# EAGLE schematic LiFePo4 Charger Single to Chain 3.2 SMD -- Finished (EAGLE 6.2)
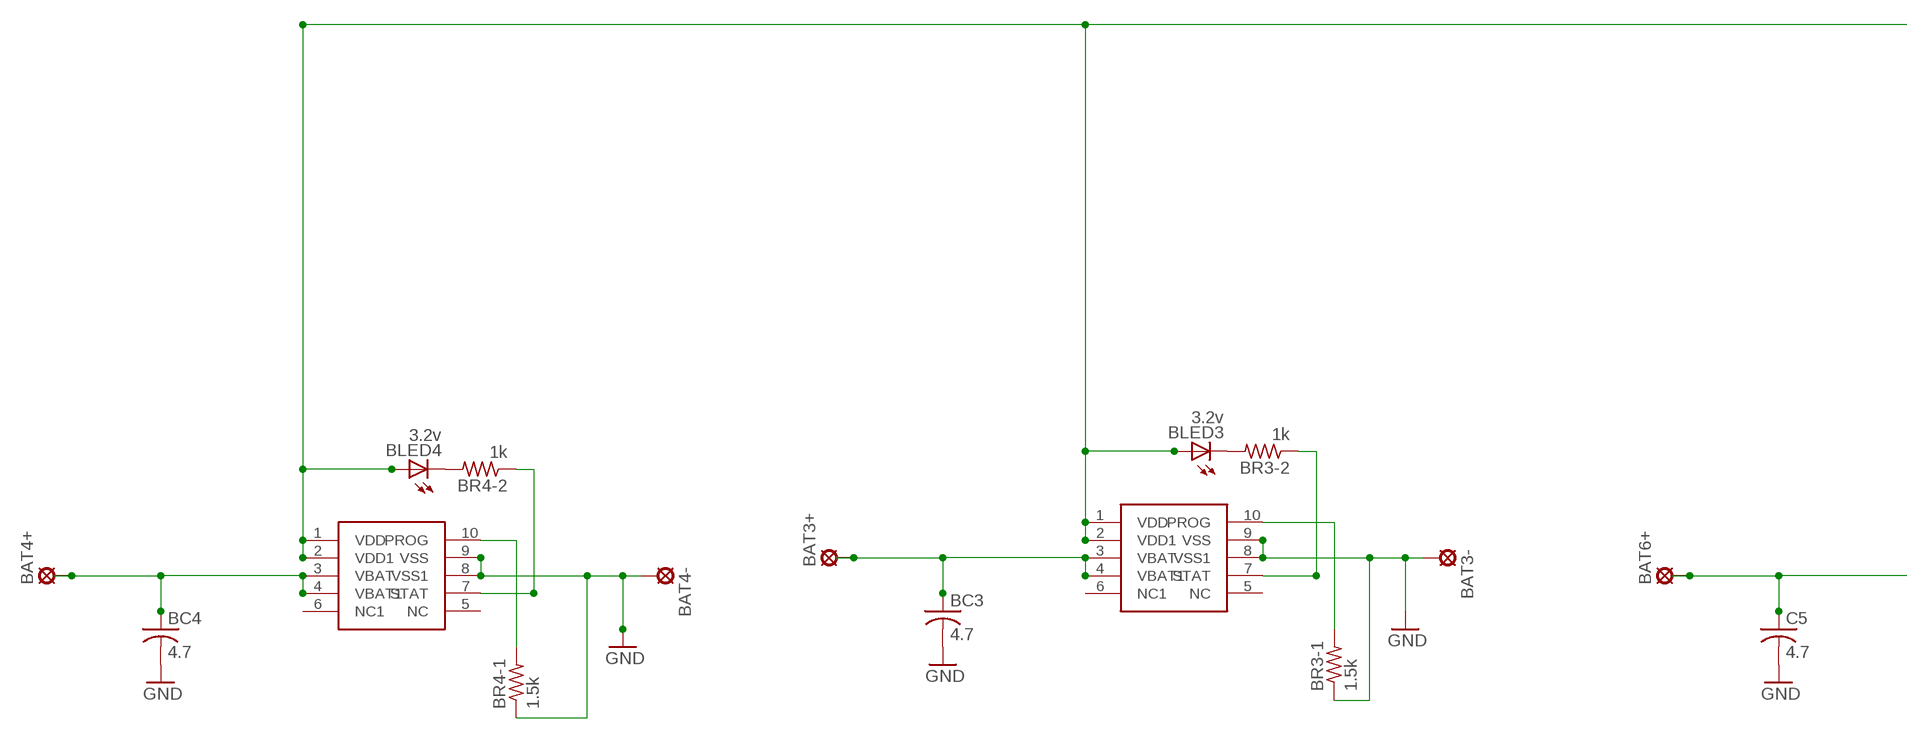
[diagram p0: schematic, sheet 1, part 1 of 2]
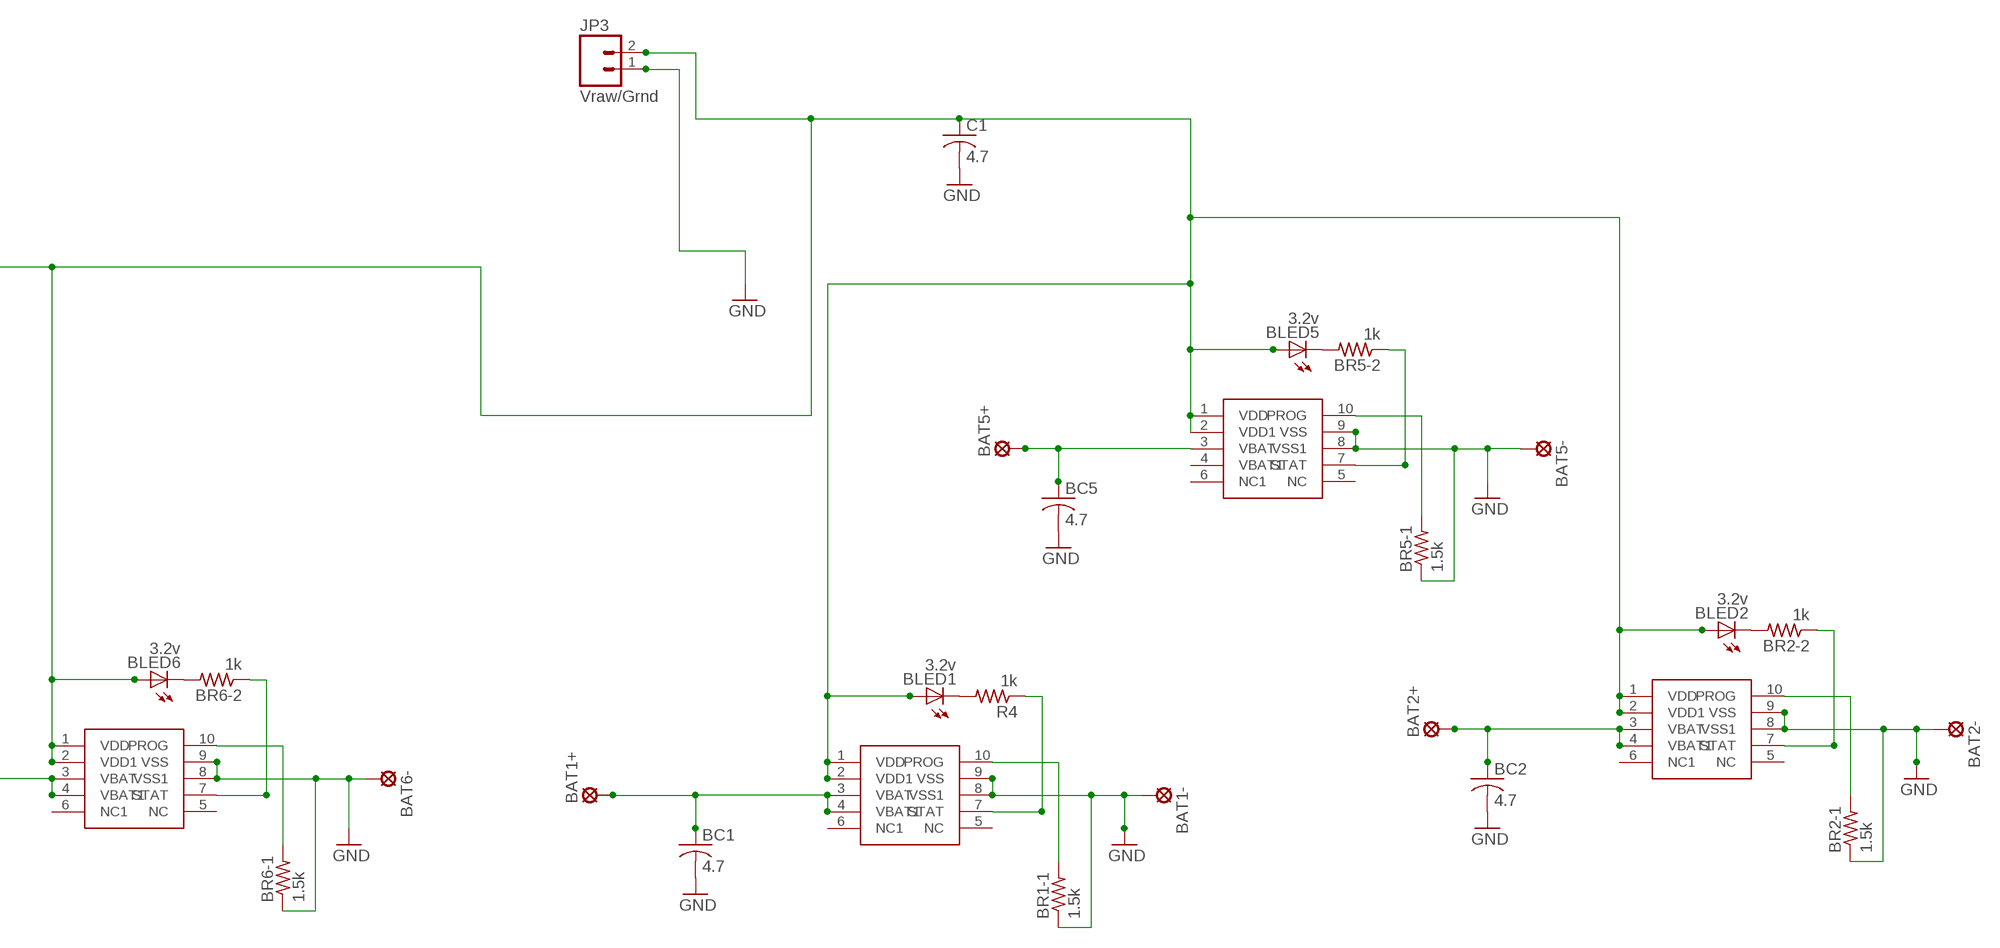
[diagram p1: schematic, sheet 1, part 2 of 2]

## Parts
BAT1+  SE14  [SE14]
BAT1-  SE14  [SE14]
BAT2+  SE14  [SE14]
BAT2-  SE14  [SE14]
BAT3+  SE14  [SE14]
BAT3-  SE14  [SE14]
BAT4+  SE14  [SE14]
BAT4-  SE14  [SE14]
BAT5+  SE14  [SE14]
BAT5-  SE14  [SE14]
BAT6+  SE14  [SE14]
BAT6-  SE14  [SE14]
BC1  4.7  C-USC0805  [C0805]
BC2  4.7  C-USC0805  [C0805]
BC3  4.7  C-USC0805  [C0805]
BC4  4.7  C-USC0805  [C0805]
BC5  4.7  C-USC0805  [C0805]
BLED1  3.2v  LEDSML0603  [SML0603]
BLED2  3.2v  LEDSML0603  [SML0603]
BLED3  3.2v  LEDSML0603  [SML0603]
BLED4  3.2v  LEDSML0603  [SML0603]
BLED5  3.2v  LEDSML0603  [SML0603]
BLED6  3.2v  LEDSML0603  [SML0603]
BR1-1  1.5k  R-US_R0805  [R0805]
BR2-1  1.5k  R-US_R0805  [R0805]
BR2-2  1k  R-US_R0805  [R0805]
BR3-1  1.5k  R-US_R0805  [R0805]
BR3-2  1k  R-US_R0805  [R0805]
BR4-1  1.5k  R-US_R0805  [R0805]
BR4-2  1k  R-US_R0805  [R0805]
BR5-1  1.5k  R-US_R0805  [R0805]
BR5-2  1k  R-US_R0805  [R0805]
BR6-1  1.5k  R-US_R0805  [R0805]
BR6-2  1k  R-US_R0805  [R0805]
C1  4.7  C-USC0805  [C0805]
C5  4.7  C-USC0805  [C0805]
IC2  MCP73123/223  [MCP73123/223]
IC4  MCP73123/223  [MCP73123/223]
JP3  Vraw/Grnd  M02PTH  [1X02]
R4  1k  R-US_R0805  [R0805]
U$1  MCP73123/223  [MCP73123/223]
U$3  MCP73123/223  [MCP73123/223]
U$5  MCP73123/223  [MCP73123/223]
U$8  MCP73123/223  [MCP73123/223]

## Nets
BC6: BAT6+.MP C5.1 U$3.3(VBAT) U$3.4(VBAT1)
BR1-2: R4.1 U$1.7(STAT)
GND: BAT1-.MP BAT2-.MP BAT3-.MP BAT4-.MP BAT5-.MP BAT6-.MP BC1.2 BC2.2 BC3.2 BC4.2 BC5.2 BR1-1.1 BR2-1.1 BR3-1.1 BR4-1.1 BR5-1.1 BR6-1.1 C1.2 C5.2 IC2.8(VSS1) IC2.9(VSS) IC4.8(VSS1) IC4.9(VSS) JP3.1 U$1.8(VSS1) U$1.9(VSS) U$3.8(VSS1) U$3.9(VSS) U$5.8(VSS1) U$5.9(VSS) U$8.8(VSS1) U$8.9(VSS)
N$1: BLED1.A BLED2.A BLED3.A BLED4.A BLED5.A BLED6.A C1.1 IC2.1(VDD) IC2.2(VDD1) IC4.1(VDD) IC4.2(VDD1) JP3.2 U$1.1(VDD) U$1.2(VDD1) U$3.1(VDD) U$3.2(VDD1) U$5.1(VDD) U$5.2(VDD1) U$8.1(VDD) U$8.2(VDD1)
N$3: BAT5+.MP BC5.1 U$8.3(VBAT)
N$4: BR5-1.2 U$8.10(PROG)
N$6: BLED5.C BR5-2.2
N$7: BR5-2.1 U$8.7(STAT)
N$8: BAT1+.MP BC1.1 U$1.3(VBAT) U$1.4(VBAT1)
N$11: BR1-1.2 U$1.10(PROG)
N$12: BAT2+.MP BC2.1 IC2.3(VBAT) IC2.4(VBAT1)
N$13: BLED1.C R4.2
N$15: BR2-2.1 IC2.7(STAT)
N$16: BR2-1.2 IC2.10(PROG)
N$17: BLED2.C BR2-2.2
N$20: BR6-2.1 U$3.7(STAT)
N$21: BR6-1.2 U$3.10(PROG)
N$22: BLED6.C BR6-2.2
N$24: BAT3+.MP BC3.1 U$5.3(VBAT) U$5.4(VBAT1)
N$26: BR3-2.1 U$5.7(STAT)
N$27: BR3-1.2 U$5.10(PROG)
N$28: BLED3.C BR3-2.2
N$30: BAT4+.MP BC4.1 IC4.3(VBAT) IC4.4(VBAT1)
N$32: BR4-2.1 IC4.7(STAT)
N$33: BR4-1.2 IC4.10(PROG)
N$34: BLED4.C BR4-2.2
Unconnected: IC2.5(NC) IC2.6(NC1) IC4.5(NC) IC4.6(NC1) U$1.5(NC) U$1.6(NC1) U$3.5(NC) U$3.6(NC1) U$5.5(NC) U$5.6(NC1) U$8.4(VBAT1) U$8.5(NC) U$8.6(NC1)

## Library data of the parts
BAT1+ BAT1- BAT2+ BAT2- BAT3+ BAT3- BAT4+ BAT4- BAT5+ BAT5- BAT6+ BAT6- = solpad:SE14: SOLDER PAD E1553, drill 1,4mm, distributor Buerklin, 07F820
BC1-BC5 C1 C5 = resistor:C-US: CAPACITOR, American symbol
BLED1-BLED6 = led:LED: LED OSRAM: - CHIPLED LG R971, LG N971, LY N971, LG Q971, LY Q971, LO R971, LY R971 LH N974, LH R974 LS Q976, LO Q976, LY Q976 LO Q996 - Hyper CHIPLED LW Q18S LB Q993, LB Q99A, LB R99A - SideLED LS A670, LO A670, LY A670, LG A670, LP A670 LB A673, LV A673, LT A673, LW A673 LH A674 LY A675 LS A676, LA A676, LO A676, LY A676, LW A676 LS A679, LY A679, LG A679 - Hyper Micro SIDELED® LS Y876, LA Y876, LO Y876, LY Y876 LT Y87S - SmartLED LW L88C, LW L88S LB L89C, LB L89S, LG L890 LS L89K, LO L89K, LY L89K LS L896, LA L896, LO L896, LY L896 - TOPLED LS T670, LO T670, LY T670, LG T670, LP T670 LSG T670, LSP T670, LSY T670, LOP T670, LYG T670 LG T671, LOG T671, LSG T671 LB T673, LV T673, LT T673, LW T673 LH T674 LS T676, LA T676, LO T676, LY T676, LB T676, LH T676, LSB T676, LW T676 LB T67C, LV T67C, LT T67C, LS T67K, LO T67K, LY T67K, LW E67C LS E67B, LA E67B, LO E67B, LY E67B, LB E67C, LV E67C, LT E67C LW T67C LS T679, LY T679, LG T679 LS T770, LO T770, LY T770, LG T770, LP T770 LB T773, LV T773, LT T773, LW T773 LH T774 LS E675, LA E675, LY E675, LS T675 LS T776, LA T776, LO T776, LY T776, LB T776 LHGB T686 LT T68C, LB T68C - Hyper Mini TOPLED® LB M676 - Mini TOPLED Santana® LG M470 LS M47K, LO M47K, LY M47K Source: http://www.osram.convergy.de LUXEON: - LUMILED® LXK2-PW12-R00, LXK2-PW12-S00, LXK2-PW14-U00, LXK2-PW14-V00 LXK2-PM12-R00, LXK2-PM12-S00, LXK2-PM14-U00 LXK2-PE12-Q00, LXK2-PE12-R00, LXK2-PE12-S00, LXK2-PE14-T00, LXK2-PE14-U00 LXK2-PB12-K00, LXK2-PB12-L00, LXK2-PB12-M00, LXK2-PB14-N00, LXK2-PB14-P00, LXK2-PB14-Q00 LXK2-PR12-L00, LXK2-PR12-M00, LXK2-PR14-Q00, LXK2-PR14-R00 LXK2-PD12-Q00, LXK2-PD12-R00, LXK2-PD12-S00 LXK2-PH12-R00, LXK2-PH12-S00 LXK2-PL12-P00, LXK2-PL12-Q00, LXK2-PL12-R00 Source: www.luxeon.com KINGBRIGHT: KA-3528ASYC Source: www.kingbright.com
BR1-1 BR2-1 BR2-2 BR3-1 BR3-2 BR4-1 BR4-2 BR5-1 BR5-2 BR6-1 BR6-2 R4 = resistor:R-US_: RESISTOR, American symbol
IC2 IC4 U$1 U$3 U$5 U$8 = untitled:MCP73123/223
JP3 = SparkFun:M02: Header 2 Standard 2-pin 0.1" header. Use with straight break away headers (SKU : PRT-00116), right angle break away headers (PRT-00553), swiss pins (PRT-00743), machine pins (PRT-00117), and female headers (PRT-00115). Molex polarized connector foot print use with SKU : PRT-08233 with associated crimp pins and housings.

## Net classes
0 default: width 0.025 mm, drill 0.025 mm, clearance 0.025 mm